# Altium schematic sheet DOAN1.SchDoc
size A; SheetNumber: 1; SheetTotal: 2
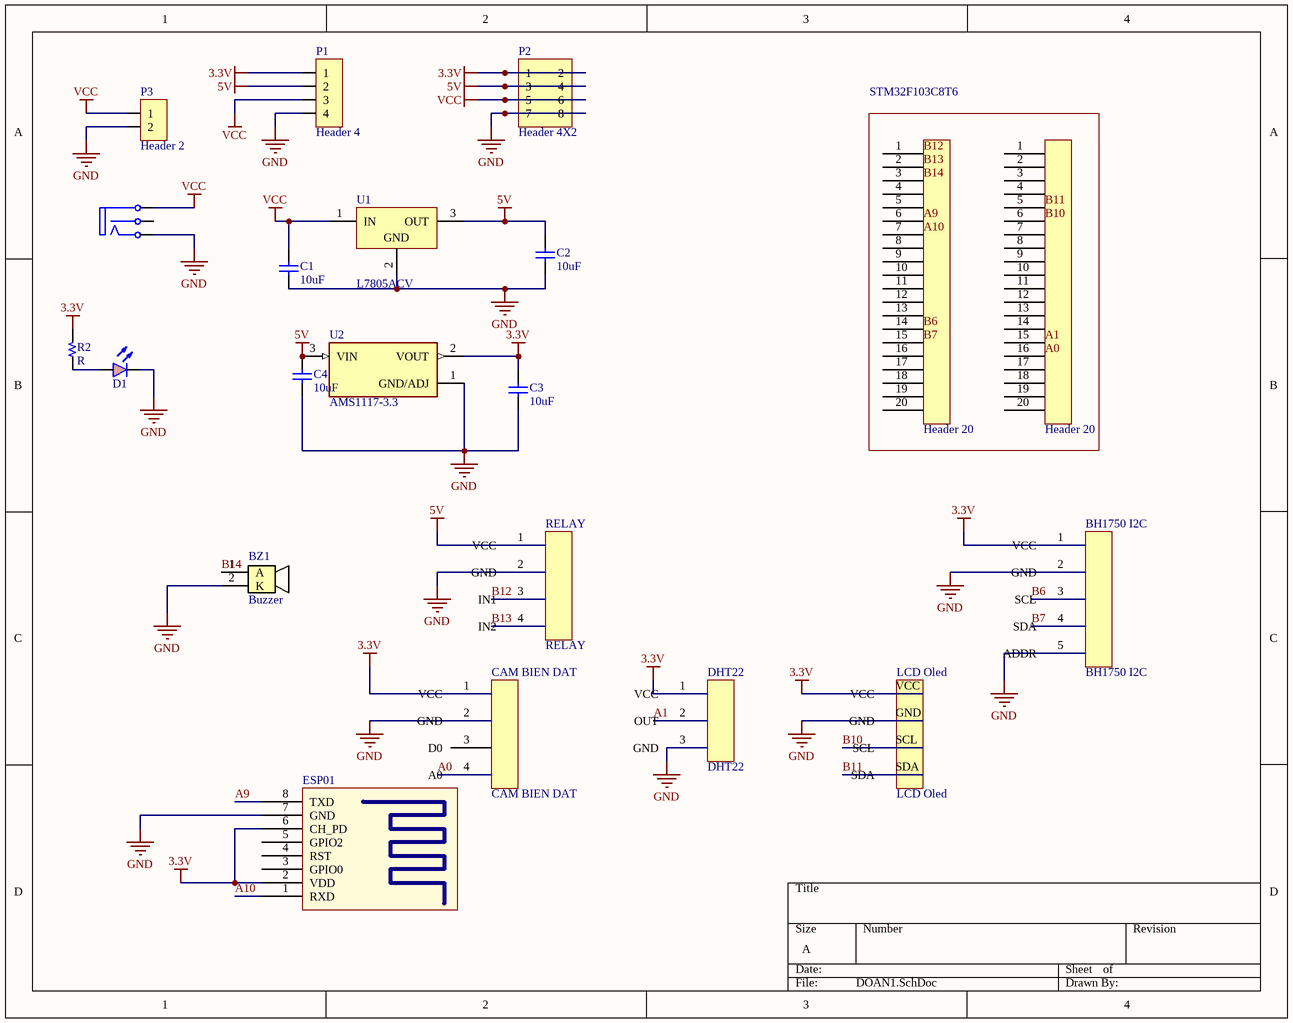
[diagram p0: DOAN1.SchDoc]

## Parts
(Parts that share a designator on the sheet are numbered #1, #2 ... from top to bottom, then left to right.)
?#1  Header 20  [HDR/Header/20]
?#2  Header 20  [HDR/Header/20]
BH1750_I2C  BH1750 I2C  [HDR/Header/5]
BZ1  Buzzer  [BUZZER]
C1  10uF  [CAP Ceramic/W200]
C2  10uF  [CAP Ceramic/W200]
C3  10uF  [CAP Ceramic/W200]
C4  10uF  [CAP Ceramic/W200]
CAM_BIEN_DAT  CAM BIEN DAT  [HDR/Header/4]
CON1  CON DC PWR  [CONN/DC/PWR/5.0MM]  (value not drawn)
D1  LED RED  [LED 10MM - RED]  (value not drawn)
DHT22  DHT22  [HDR/Header/3]
ESP01  Component_1  [ESP8266 ESP-01]  (value not drawn)
LCD_Oled  LCD Oled  [HDR/Header/4]
P1  Header 4  [HDR/Header/4]
P2  Header 4X2  [HDR/Header/8/DL]
P3  Header 2  [HDR/Terminal/2]
R2  R  [R 1/4W/300]
RELAY  RELAY  [HDR/Header/4]
U1  L7805ACV  [PCBComponent_1 - duplicate]
U2  AMS1117-3.3  [SOT229P700X180-4N]

## Sub-sheets
STM32F103C8T6 = File Name: no entries

## Nets
3.3V: BH1750_I2C.1(VCC) C3.1 CAM_BIEN_DAT.1(VCC) DHT22.1(VCC) ESP01.2(VDD) ESP01.6(CH_PD) LCD_Oled.VCC P1.1 P2.1 P2.2 R2.2 U2.2(VOUT)
5V: C2.1 C4.1 P1.2 P2.3 P2.4 RELAY.1(VCC) U1.3(OUT) U2.3(VIN)
GND: BH1750_I2C.2(GND) BH1750_I2C.5(ADDR) BZ1.2(K) C1.2 C2.2 C3.2 C4.2 CAM_BIEN_DAT.2(GND) CON1.2(T) D1.2(K) DHT22.3(GND) ESP01.7(GND) LCD_Oled.GND P1.4 P2.7 P2.8 P3.2 RELAY.2(GND) U1.2(GND) U2.1(GND/ADJ)
VCC: C1.1 CON1.3(TN) P1.3 P2.5 P2.6 P3.1 U1.1(IN)
A0: ?#2.16 CAM_BIEN_DAT.4(A0)
A1: ?#2.15 DHT22.2(OUT)
A9: ?#1.6 ESP01.8(TXD)
A10: ?#1.7 ESP01.1(RXD)
B6: ?#1.14 BH1750_I2C.3(SCL)
B7: ?#1.15 BH1750_I2C.4(SDA)
B10: ?#2.6 LCD_Oled.SCL
B11: ?#2.5 LCD_Oled.SDA
B12: ?#1.1 RELAY.3(IN1)
B13: ?#1.2 RELAY.4(IN2)
B14: ?#1.3 BZ1.1(A)
NetD1_1: D1.1(A) R2.1

Not connected (* = marked no-connect by the designer): ?#1 4 5 8 9 10 11 12 13 16 17 18 19 20; ?#2 1 2 3 4 7 8 9 10 11 12 13 14 17 18 19 20; CAM_BIEN_DAT 3(D0); CON1 1(S); ESP01 3(GPIO0) 4(RST) 5(GPIO2)

## Library data of the parts
C1-C4 = Capacitor NP: Capacitor non-pol
CON1 = CON DC PWR: DC input connector
D1 = LED RED: Typical LED 3-pin 2-color
P1 = Header 4: Header, 4-Pin
P2 = Header 4X2: Header, 4-Pin, Dual row
P3 = Header 2: Header, 2-Pin
R2 = Resistor
U1 = CMP-0244-00484-1: Positive Voltage Regulator, 5V, 3-Pin TO-220; DatasheetVersion: 16/11/2011; ComponentLink2Description: Datasheet; ComponentLink3Description: Package Specification; ComponentLink2URL: http://www.st.com/internet/com/TECHNICAL_RESOURCES/TECHNICAL_LITERATURE/DATASHEET/CD00000444.pdf; PackageDescription: TO, Thru-Hole, Vertical, Heatsink Mounted; 3 In-Line Leads; Pitch 2.54 mm; ComponentLink3URL: http://www.st.com/internet/com/TECHNICAL_RESOURCES/TECHNICAL_LITERATURE/PACKAGE_INFORMATION/CD00004649.pdf; PackageReference: TO220; ComponentLink1URL: http://www.st.com; PackageVersion: ver3.0; ComponentLink1Description: Manufacturer URL
U2 = AMS1117-3.3: Sot223/Pkg 1-Amp 3.3-Volt Low Drop Out Voltage Regulatator; MF: Advanced Monolithic Systems; Package: SOT-223 Seeed Technology; Value: *; Check_prices: https://www.snapeda.com/parts/AMS1117-3.3/Advanced+Monolithic+Systems/view-part/?ref=eda; Price: None; Availability: Not in stock; MP: AMS1117-3.3; SnapEDA_Link: https://www.snapeda.com/parts/AMS1117-3.3/Advanced+Monolithic+Systems/view-part/?ref=snap